# EAGLE schematic pcb-schema (EAGLE 9.2.0)
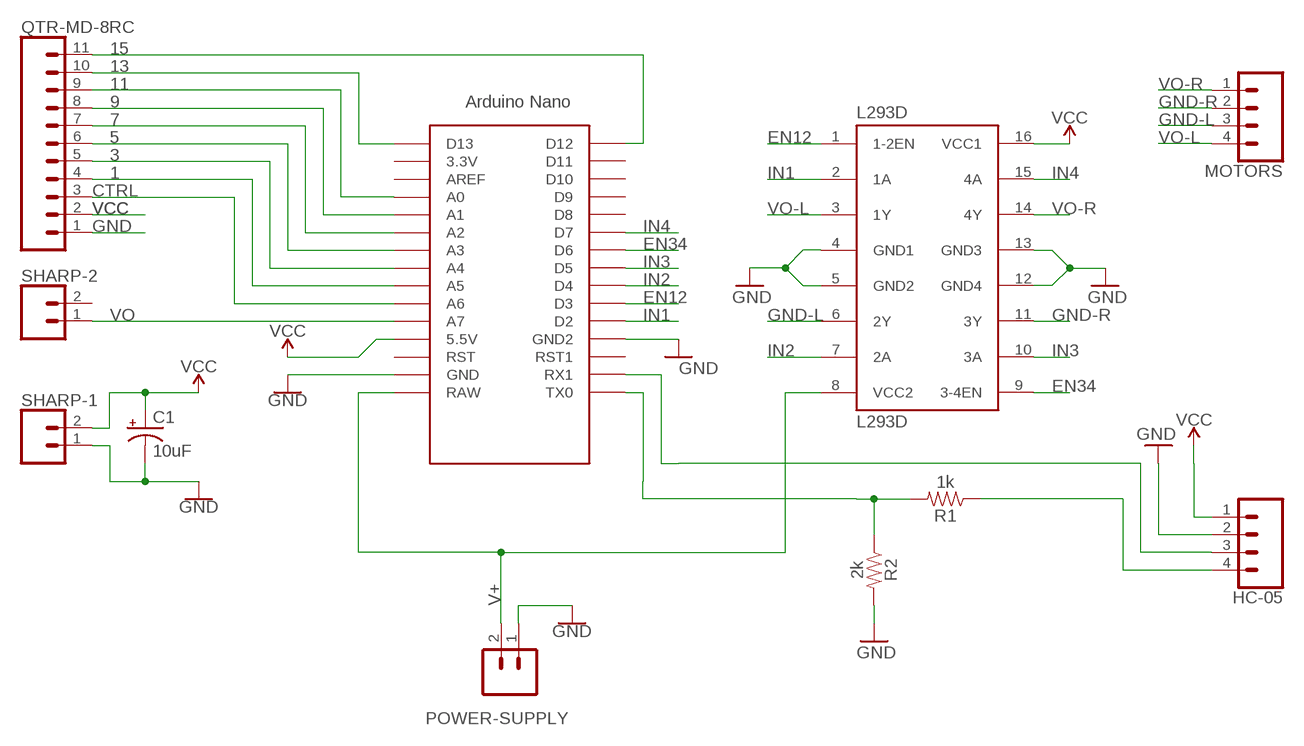
[diagram p0: schematic, sheet 1]

## Parts
C1  10uF  10UF-POLAR-RADIAL-2.5MM-25V-20%  [CPOL-RADIAL-2.5MM-5MM]
HC-05  CONN_04  [1X04]
L293D  L293D  [DIL16]
MOTORS  CONN_04  [1X04]
POWER-SUPPLY  CONN_025MM  [SCREWTERMINAL-5MM-2]
QTR-MD-8RC  CONN_11  [1X11]
R1  1k  1KOHM-HORIZ-1/4W-1%  [AXIAL-0.3]
R2  2k  1KOHM-HORIZ-1/4W-1%  [AXIAL-0.3]
SHARP-1  CONN_025MM  [SCREWTERMINAL-5MM-2]
SHARP-2  CONN_025MM  [SCREWTERMINAL-5MM-2]
U$1  NANO  [NANO]

## Nets
1: QTR-MD-8RC.4 U$1.A5
3: QTR-MD-8RC.5 U$1.A4
5: QTR-MD-8RC.6 U$1.A3
7: QTR-MD-8RC.7 U$1.A2
9: QTR-MD-8RC.8 U$1.A1
11: QTR-MD-8RC.9 U$1.A0
13: QTR-MD-8RC.10 U$1.D13
15: QTR-MD-8RC.11 U$1.D12
CTRL: QTR-MD-8RC.3 U$1.A6
EN12: L293D.1(1-2EN) U$1.D3
EN34: L293D.9(3-4EN) U$1.D6
GND: C1.2(-) HC-05.2 L293D.4(GND1) L293D.5(GND2) POWER-SUPPLY.1 QTR-MD-8RC.1 R2.P$2 SHARP-1.1 U$1.GND U$1.GND1(GND2)
GND-L: L293D.6(2Y) MOTORS.3
GND-R: L293D.11(3Y) MOTORS.2
IN1: L293D.2(1A) U$1.D2
IN2: L293D.7(2A) U$1.D4
IN3: L293D.10(3A) U$1.D5
IN4: L293D.15(4A) U$1.D7
N$5: L293D.12(GND4) L293D.13(GND3) ; supply symbol labelled GND
N$7: HC-05.3 U$1.RX1
N$9: HC-05.4 R1.P$1
N$22: R1.P$2 R2.P$1 U$1.TX0
V+: L293D.8(VCC2) POWER-SUPPLY.2 U$1.RAW
VCC: C1.1(+) HC-05.1 L293D.16(VCC1) QTR-MD-8RC.2 SHARP-1.2 U$1.5V(5.5V)
VO: SHARP-2.1 U$1.A7
VO-L: L293D.3(1Y) MOTORS.4
VO-R: L293D.14(4Y) MOTORS.1
Unconnected: SHARP-2.2 U$1.3.3V U$1.AREF U$1.D8 U$1.D9 U$1.D10 U$1.D11 U$1.ICSP1 U$1.ICSP2 U$1.ICSP3 U$1.ICSP4 U$1.ICSP5 U$1.ICSP6 U$1.RST U$1.RST1

## Library data of the parts
C1 = SparkFun-Capacitors:10UF-POLAR: 10.0µF polarized capacitors A capacitor is a passive two-terminal electrical component used to store electrical energy temporarily in an electric field.; PROD_ID: CAP-08440
HC-05 MOTORS = SparkFun-Connectors:CONN_04: Multi connection point. Often used as Generic Header-pin footprint for 0.1 inch spaced/style header connections On any of the 0.1 inch spaced packages, you can populate with these: Break Away Headers - Straight <https://www.sparkfun.com/products/116> (PRT-00116) Break Away Male Headers - Right Angle <https://www.sparkfun.com/products/553> (PRT-00553) Female Headers <https://www.sparkfun.com/products/115> (PRT-00115) Break Away Headers - Machine Pin <https://www.sparkfun.com/products/117> (PRT-00117) Break Away Female Headers - Swiss Machine Pin <https://www.sparkfun.com/products/743> (PRT-00743) For SCREWTERMINALS and SPRING TERMINALS visit here: Screw Terimnals on SparkFun.com <https://www.sparkfun.com/search/results?term=Screw+Terminals> (5mm/3.5mm/2.54mm spacing) This device is also useful as a general connection point to wire up your design to another part of your project. Our various solder wires solder well into these plated through hole pads. Hook-Up Wire - Assortment (Stranded, 22 AWG) <https://www.sparkfun.com/products/11375> (PRT-11375) Hook-Up Wire - Assortment (Solid Core, 22 AWG) <https://www.sparkfun.com/products/11367> (PRT-11367) View the entire wire category on our website here <https://www.sparkfun.com/categories/141> Special notes: Molex polarized connector foot print use with SKU : PRT-08231 with associated crimp pins and housings. 1MM SMD Version SKU: PRT-10208; PROD_ID: CONN-09696
L293D = st-microelectronics:L293D: PUSH-PULL 4 CHANNEL DRIVER; MPN: L293D; OC_FARNELL: 9589619; OC_NEWARK: 56P8249
POWER-SUPPLY SHARP-1 SHARP-2 = SparkFun-Connectors:CONN_02: Multi connection point. Often used as Generic Header-pin footprint for 0.1 inch spaced/style header connections On any of the 0.1 inch spaced packages, you can populate with these: Break Away Headers - Straight <https://www.sparkfun.com/products/116> (PRT-00116) Break Away Male Headers - Right Angle <https://www.sparkfun.com/products/553> (PRT-00553) Female Headers <https://www.sparkfun.com/products/115> (PRT-00115) Break Away Headers - Machine Pin <https://www.sparkfun.com/products/117> (PRT-00117) Break Away Female Headers - Swiss Machine Pin <https://www.sparkfun.com/products/743> (PRT-00743) For SCREWTERMINALS and SPRING TERMINALS visit here: Screw Terimnals on SparkFun.com <https://www.sparkfun.com/search/results?term=Screw+Terminals> (5mm/3.5mm/2.54mm spacing) This device is also useful as a general connection point to wire up your design to another part of your project. Our various solder wires solder well into these plated through hole pads. Hook-Up Wire - Assortment (Stranded, 22 AWG) <https://www.sparkfun.com/products/11375> (PRT-11375) Hook-Up Wire - Assortment (Solid Core, 22 AWG) <https://www.sparkfun.com/products/11367> (PRT-11367) View the entire wire category on our website here <https://www.sparkfun.com/categories/141> Special notes: Molex polarized connector foot print use with: PRT-08233 with associated crimp pins and housings. 2.54_SCREWTERM for use with PRT-10571. 3.5mm Screw Terminal footprints for PRT-08084 5mm Screw Terminal footprints for use with PRT-08432; SF_SKU: PRT-08432
QTR-MD-8RC = SparkFun-Connectors:CONN_11: Multi connection point. Often used as Generic Header-pin footprint for 0.1 inch spaced/style header connections On any of the 0.1 inch spaced packages, you can populate with these: Break Away Headers - Straight <https://www.sparkfun.com/products/116> (PRT-00116) Break Away Male Headers - Right Angle <https://www.sparkfun.com/products/553> (PRT-00553) Female Headers <https://www.sparkfun.com/products/115> (PRT-00115) Break Away Headers - Machine Pin <https://www.sparkfun.com/products/117> (PRT-00117) Break Away Female Headers - Swiss Machine Pin <https://www.sparkfun.com/products/743> (PRT-00743) For SCREWTERMINALS and SPRING TERMINALS visit here: Screw Terimnals on SparkFun.com <https://www.sparkfun.com/search/results?term=Screw+Terminals> (5mm/3.5mm/2.54mm spacing) This device is also useful as a general connection point to wire up your design to another part of your project. Our various solder wires solder well into these plated through hole pads. Hook-Up Wire - Assortment (Stranded, 22 AWG) <https://www.sparkfun.com/products/11375> (PRT-11375) Hook-Up Wire - Assortment (Solid Core, 22 AWG) <https://www.sparkfun.com/products/11367> (PRT-11367) View the entire wire category on our website here <https://www.sparkfun.com/categories/141>
R1 = SparkFun-Resistors:1KOHM: 1kΩ resistor A resistor is a passive two-terminal electrical component that implements electrical resistance as a circuit element. Resistors act to reduce current flow, and, at the same time, act to lower voltage levels within circuits. - Wikipedia; PROD_ID: RES-12182
R2 = SparkFun-Resistors:1KOHM: 1kΩ resistor A resistor is a passive two-terminal electrical component that implements electrical resistance as a circuit element. Resistors act to reduce current flow, and, at the same time, act to lower voltage levels within circuits. - Wikipedia; PROD_ID: RES-12182; VALUE: 1k
U$1 = Arduino-clone:NANO: Arduino Nano